# Altium schematic sheet Microcontroller.SchDoc
size A3; SheetNumber: 2; SheetTotal: 6; SPICEModelCacheJBUTDGHS: <root> / <DocumentId>JBUTDGHS</DocumentId> / <CacheFrame Number="0"> / <Model Name="cap" Kind="MDL"> / <Text>*Default semiconductor capacitor / .MODEL CAP C()</Text> / </Model> / </CacheFrame> / </root>
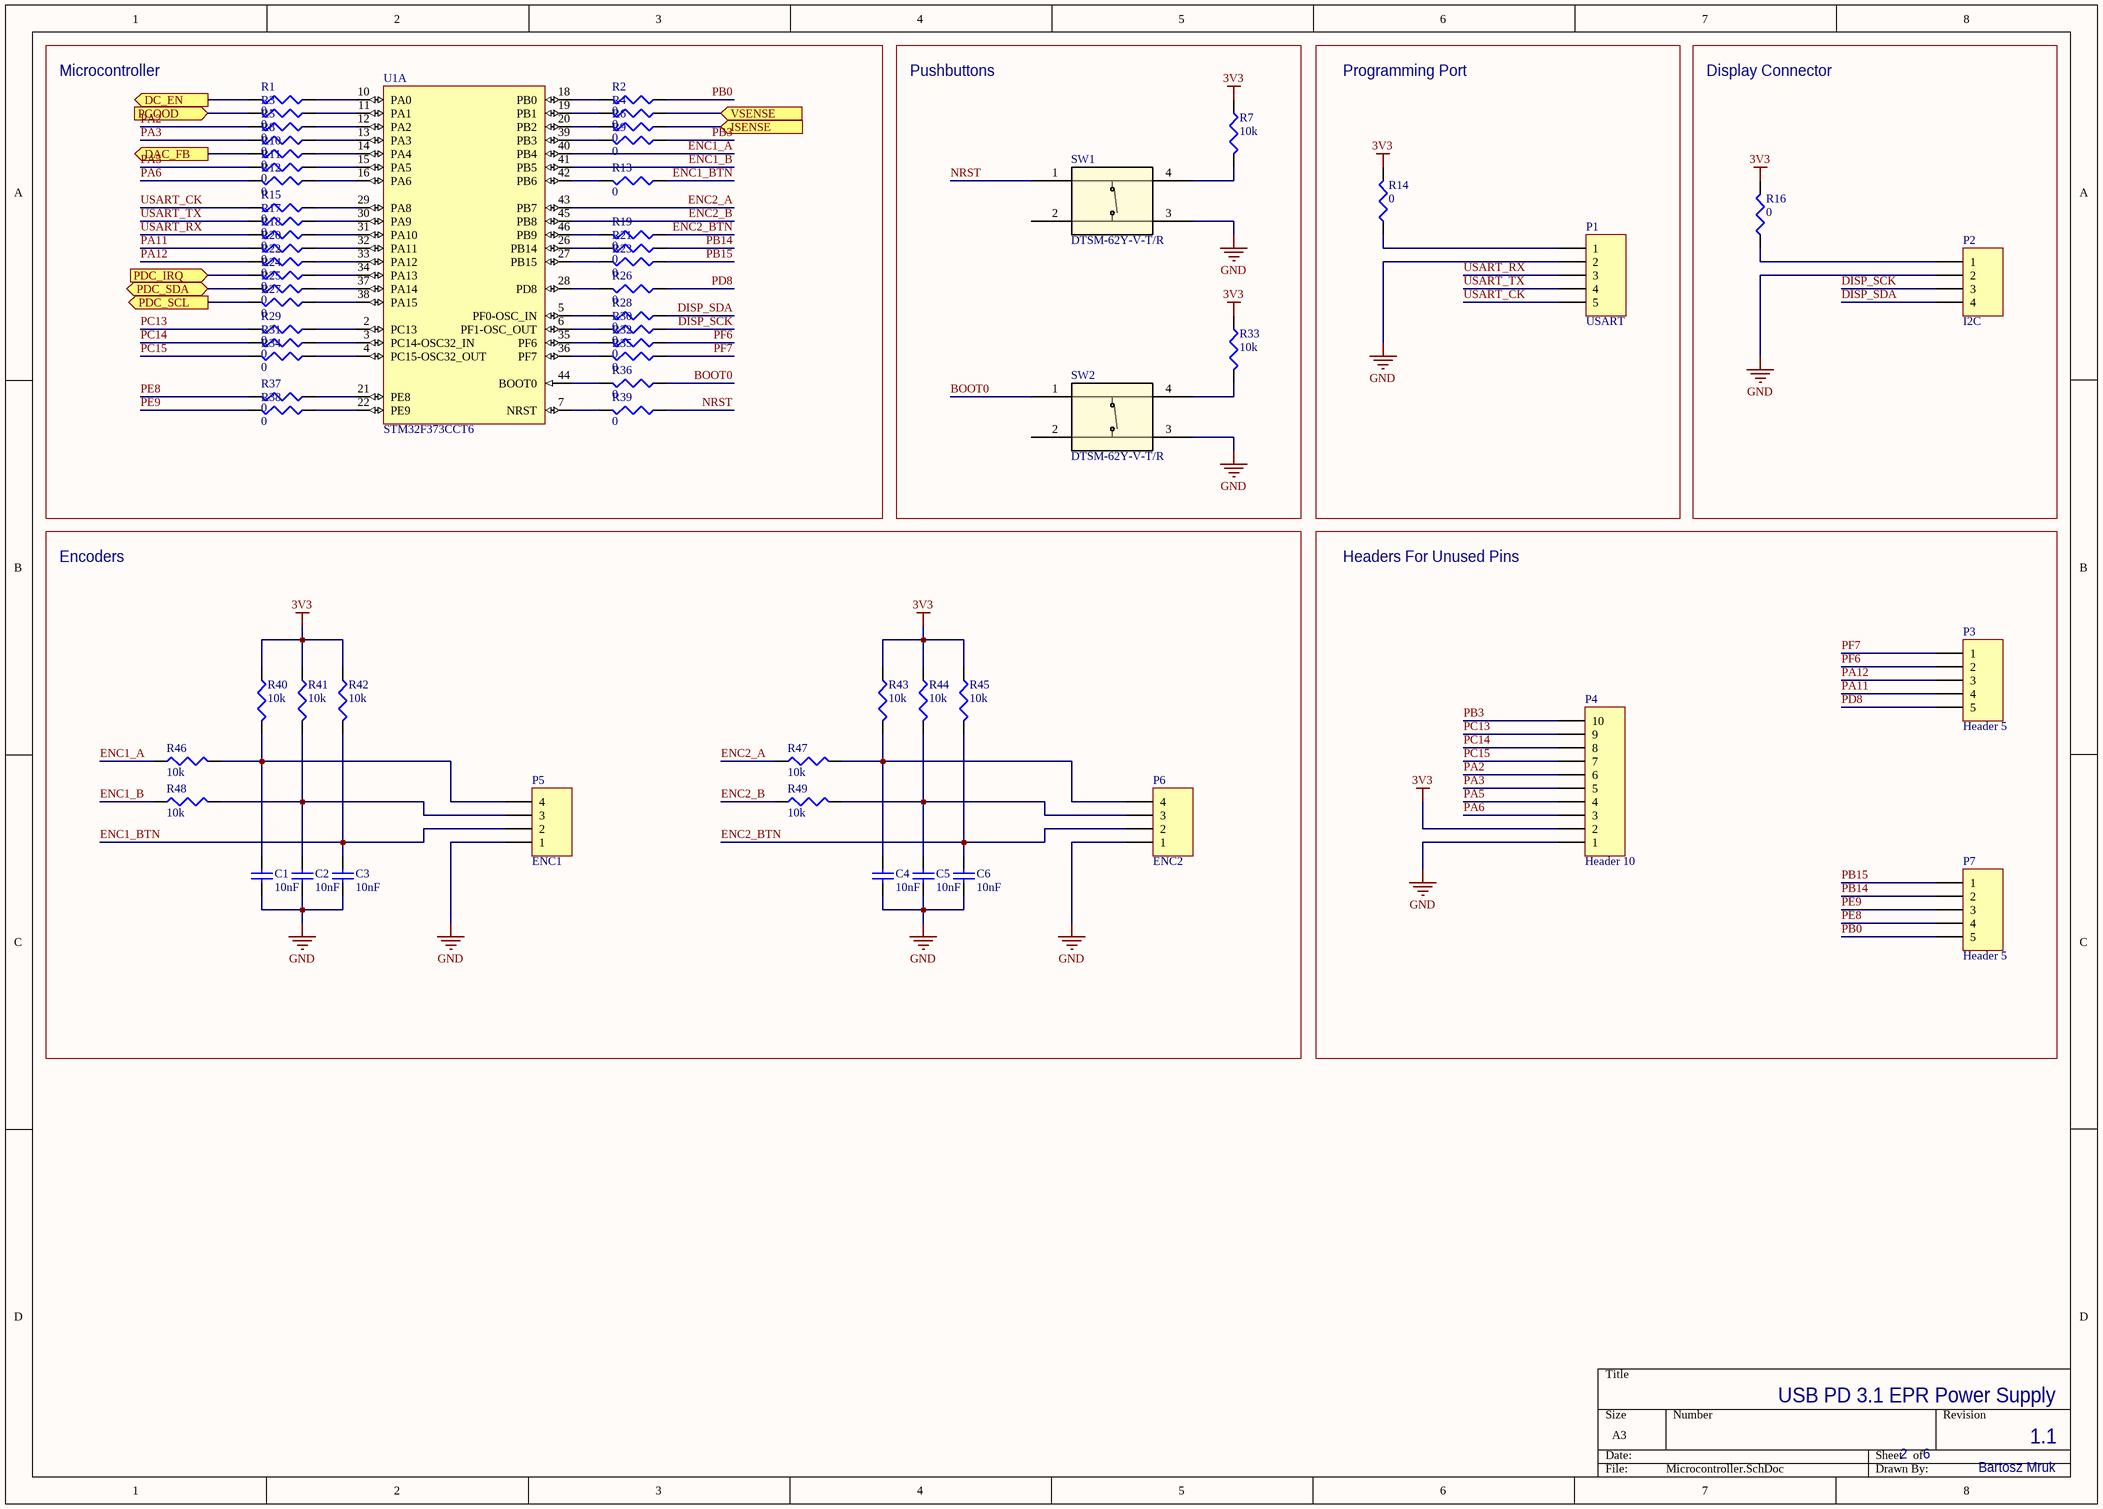
[diagram p0: Microcontroller.SchDoc]

## Parts
C1  value 10nF  [1608[0603]]  (hidden comment: Cap Semi)
C2  value 10nF  [1608[0603]]  (hidden comment: Cap Semi)
C3  value 10nF  [1608[0603]]  (hidden comment: Cap Semi)
C4  value 10nF  [1608[0603]]  (hidden comment: Cap Semi)
C5  value 10nF  [1608[0603]]  (hidden comment: Cap Semi)
C6  value 10nF  [1608[0603]]  (hidden comment: Cap Semi)
P1  USART  [HDR1X5]
P2  I2C  [HDR1X4]
P3  Header 5  [HDR1X5]
P4  Header 10  [HDR1X10]
P5  ENC1  [HDR1X4]
P6  ENC2  [HDR1X4]
P7  Header 5  [HDR1X5]
R1  value 0  [J1-0603]
R2  value 0  [J1-0603]
R3  value 0  [J1-0603]
R4  value 0  [J1-0603]
R5  value 0  [J1-0603]
R6  value 0  [J1-0603]
R7  value 10k  [J1-0603]
R8  value 0  [J1-0603]
R9  value 0  [J1-0603]
R10  value 0  [J1-0603]
R11  value 0  [J1-0603]
R12  value 0  [J1-0603]
R13  value 0  [J1-0603]
R14  value 0  [J1-0603]  (hidden comment: Res3)
R15  value 0  [J1-0603]
R16  value 0  [J1-0603]  (hidden comment: Res3)
R17  value 0  [J1-0603]
R18  value 0  [J1-0603]
R19  value 0  [J1-0603]
R20  value 0  [J1-0603]
R21  value 0  [J1-0603]
R22  value 0  [J1-0603]
R23  value 0  [J1-0603]
R24  value 0  [J1-0603]
R25  value 0  [J1-0603]
R26  value 0  [J1-0603]
R27  value 0  [J1-0603]
R28  value 0  [J1-0603]
R29  value 0  [J1-0603]
R30  value 0  [J1-0603]
R31  value 0  [J1-0603]
R32  value 0  [J1-0603]
R33  value 10k  [J1-0603]
R34  value 0  [J1-0603]
R35  value 0  [J1-0603]
R36  value 0  [J1-0603]
R37  value 0  [J1-0603]
R38  value 0  [J1-0603]
R39  value 0  [J1-0603]
R40  value 10k  [J1-0603]
R41  value 10k  [J1-0603]
R42  value 10k  [J1-0603]
R43  value 10k  [J1-0603]
R44  value 10k  [J1-0603]
R45  value 10k  [J1-0603]
R46  value 10k  [J1-0603]
R47  value 10k  [J1-0603]
R48  value 10k  [J1-0603]
R49  value 10k  [J1-0603]
SW1  DTSM-62Y-V-T/R  [DTSM-62_DIP]
SW2  DTSM-62Y-V-T/R  [DTSM-62_DIP]
U1  STM32F373CCT6  [STM-LQFP48_M]  (part A of 2)

## Blocks framed on the sheet
Microcontroller: R1-R6 R8-R13 R15 R17-R32 R34-R39 U1
Pushbuttons: R7 R33 SW1 SW2
Programming Port: P1 R14
Display Connector: P2 R16
Encoders: C1-C6 P5 P6 R40-R49
Headers For Unused Pins: P3 P4 P7

## Ports
DAC_FB (out), DC_EN (out), ISENSE (in), PDC_IRQ (in), PDC_SCL (out), PDC_SDA (bidir), PGOOD (in), VSENSE (in)

## Nets
3V3: P4.2 R7.1 R14.2 R16.2 R33.1 R40.1 R41.1 R42.1 R43.1 R44.1 R45.1
GND: C1.1 C2.1 C3.1 C4.1 C5.1 C6.1 P1.2 P2.2 P4.1 P5.1 P6.1 SW1.3 SW2.3
BOOT0: R36.1 SW2.1
DAC_FB: R10.2 ; port DAC_FB
DC_EN: R1.2 ; port DC_EN
DISP_SCK: P2.3 R30.1
DISP_SDA: P2.4 R28.1
ENC1_A: R46.1 U1.40(PB4)
ENC1_B: R48.1 U1.41(PB5)
ENC1_BTN: C3.2 P5.2 R13.1 R42.2
ENC2_A: R47.1 U1.43(PB7)
ENC2_B: R49.1 U1.45(PB8)
ENC2_BTN: C6.2 P6.2 R19.1 R45.2
ISENSE: R6.1 ; port ISENSE
NRST: R39.1 SW1.1
PA2: P4.6 R5.2
PA3: P4.5 R8.2
PA5: P4.4 R11.2
PA6: P4.3 R12.2
PA11: P3.4 R20.2
PA12: P3.3 R22.2
PB0: P7.5 R2.1
PB3: P4.10 R9.1
PB14: P7.2 R21.1
PB15: P7.1 R23.1
PC13: P4.9 R29.2
PC14: P4.8 R31.2
PC15: P4.7 R34.2
PD8: P3.5 R26.1
PDC_IRQ: R24.2 ; port PDC_IRQ
PDC_SCL: R27.2 ; port PDC_SCL
PDC_SDA: R25.2 ; port PDC_SDA
PE8: P7.4 R37.2
PE9: P7.3 R38.2
PF6: P3.2 R32.1
PF7: P3.1 R35.1
PGOOD: R3.2 ; port PGOOD
USART_CK: P1.5 R15.2
USART_RX: P1.3 R18.2
USART_TX: P1.4 R17.2
VSENSE: R4.1 ; port VSENSE
NetC1_2: C1.2 P5.4 R40.2 R46.2
NetC2_2: C2.2 P5.3 R41.2 R48.2
NetC4_2: C4.2 P6.4 R43.2 R47.2
NetC5_2: C5.2 P6.3 R44.2 R49.2
NetP1_1: P1.1 R14.1
NetP2_1: P2.1 R16.1
NetR1_1: R1.1 U1.10(PA0)
NetR2_2: R2.2 U1.18(PB0)
NetR3_1: R3.1 U1.11(PA1)
NetR4_2: R4.2 U1.19(PB1)
NetR5_1: R5.1 U1.12(PA2)
NetR6_2: R6.2 U1.20(PB2)
NetR7_2: R7.2 SW1.4
NetR8_1: R8.1 U1.13(PA3)
NetR9_2: R9.2 U1.39(PB3)
NetR10_1: R10.1 U1.14(PA4)
NetR11_1: R11.1 U1.15(PA5)
NetR12_1: R12.1 U1.16(PA6)
NetR13_2: R13.2 U1.42(PB6)
NetR15_1: R15.1 U1.29(PA8)
NetR17_1: R17.1 U1.30(PA9)
NetR18_1: R18.1 U1.31(PA10)
NetR19_2: R19.2 U1.46(PB9)
NetR20_1: R20.1 U1.32(PA11)
NetR21_2: R21.2 U1.26(PB14)
NetR22_1: R22.1 U1.33(PA12)
NetR23_2: R23.2 U1.27(PB15)
NetR24_1: R24.1 U1.34(PA13)
NetR25_1: R25.1 U1.37(PA14)
NetR26_2: R26.2 U1.28(PD8)
NetR27_1: R27.1 U1.38(PA15)
NetR28_2: R28.2 U1.5(PF0-OSC_IN)
NetR29_1: R29.1 U1.2(PC13)
NetR30_2: R30.2 U1.6(PF1-OSC_OUT)
NetR31_1: R31.1 U1.3(PC14-OSC32_IN)
NetR32_2: R32.2 U1.35(PF6)
NetR33_2: R33.2 SW2.4
NetR34_1: R34.1 U1.4(PC15-OSC32_OUT)
NetR35_2: R35.2 U1.36(PF7)
NetR36_2: R36.2 U1.44(BOOT0)
NetR37_1: R37.1 U1.21(PE8)
NetR38_1: R38.1 U1.22(PE9)
NetR39_2: R39.2 U1.7(NRST)

Not connected (* = marked no-connect by the designer): SW1 2; SW2 2

## Notes on the sheet
- 2
- 6
- 1.1
- USB PD 3.1 EPR Power Supply
- Bartosz Mruk

## Library data of the parts
C1-C6 = Cap Semi: Capacitor (Semiconductor SIM Model); Published: 8-Jun-2000; LatestRevisionDate: 29-May-2009; LatestRevisionNote: IPC-7351 Footprint Added.; PackageReference: C1206; Publisher: Altium Limited; PackageDescription: Chip Capacitor
P1 P3 P7 = Header 5: Header, 5-Pin; LatestRevisionDate: 17-Jul-2002; LatestRevisionNote: Re-released for DXP Platform.; Publisher: Altium Limited
P2 P5 P6 = Header 4: Header, 4-Pin; LatestRevisionDate: 17-Jul-2002; LatestRevisionNote: Re-released for DXP Platform.; Publisher: Altium Limited
P4 = Header 10: Header, 10-Pin; LatestRevisionDate: 17-Jul-2002; LatestRevisionNote: Re-released for DXP Platform.; Publisher: Altium Limited
R1-R49 = Res3: Resistor; Published: 8-Jun-2000; LatestRevisionDate: 29-May-2009; LatestRevisionNote: IPC-7351 Footprint Added.; PackageReference: J1-0603; Publisher: Altium Limited; PackageDescription: Chip Resistor
SW1 SW2 = DTSM-62Y-V-TR: Description; Manufacturer_Name: Diptronics; Copyright: Copyright (C) 2025 Ultra Librarian. All rights reserved.; Manufacturer_Part_Number: DTSM-62Y-V-T/R; RefDes: RefDes; Type: Type
U1 = CMP-0572-00021-2: ARM Cortex-M4 32-bit MCU, 256 KB Flash, 32 KB Internal RAM, 36 I/Os, 48-pin LQFP, -40 to 85 degC, Tray; FLASH Size (Prog) (kB): 256; Internal RAM Size (kB): 32; Operating Frequency(F) (Processor speed) (MHz): 72; I/Os (High Current): 36; Supply Voltage(Vcc) min (V): 2; Mounting Technology: Surface Mount; ComponentLink2Description: Datasheet; PackageReference: LQFP48; Packing: Tray; PackageVersion: Rev. 6, 06/2013; ComponentLink1Description: Manufacturer URL; ComponentLink3Description: Package Specification; ComponentLink2URL: http://www.st.com/st-web-ui/static/active/en/resource/technical/document/datasheet/DM00046749.pdf; PartNumber: STM32F373CCT6; Core: ARM Cortex-M4; ComponentLink1URL: http://www.st.com/web/en/home.html; ComponentLink3URL: http://www.st.com/st-web-ui/static/active/en/resource/technical/document/datasheet/DM00058181.pdf; DatasheetVersion: Rev. 3; PackageDescription: 48-Pin Low Profile Quad Flat Package, 7 x 7 mm Body, 0.5 mm Pitch